# Altium project bzBldcRwDriver_Pcb_Ver02.PrjPcb
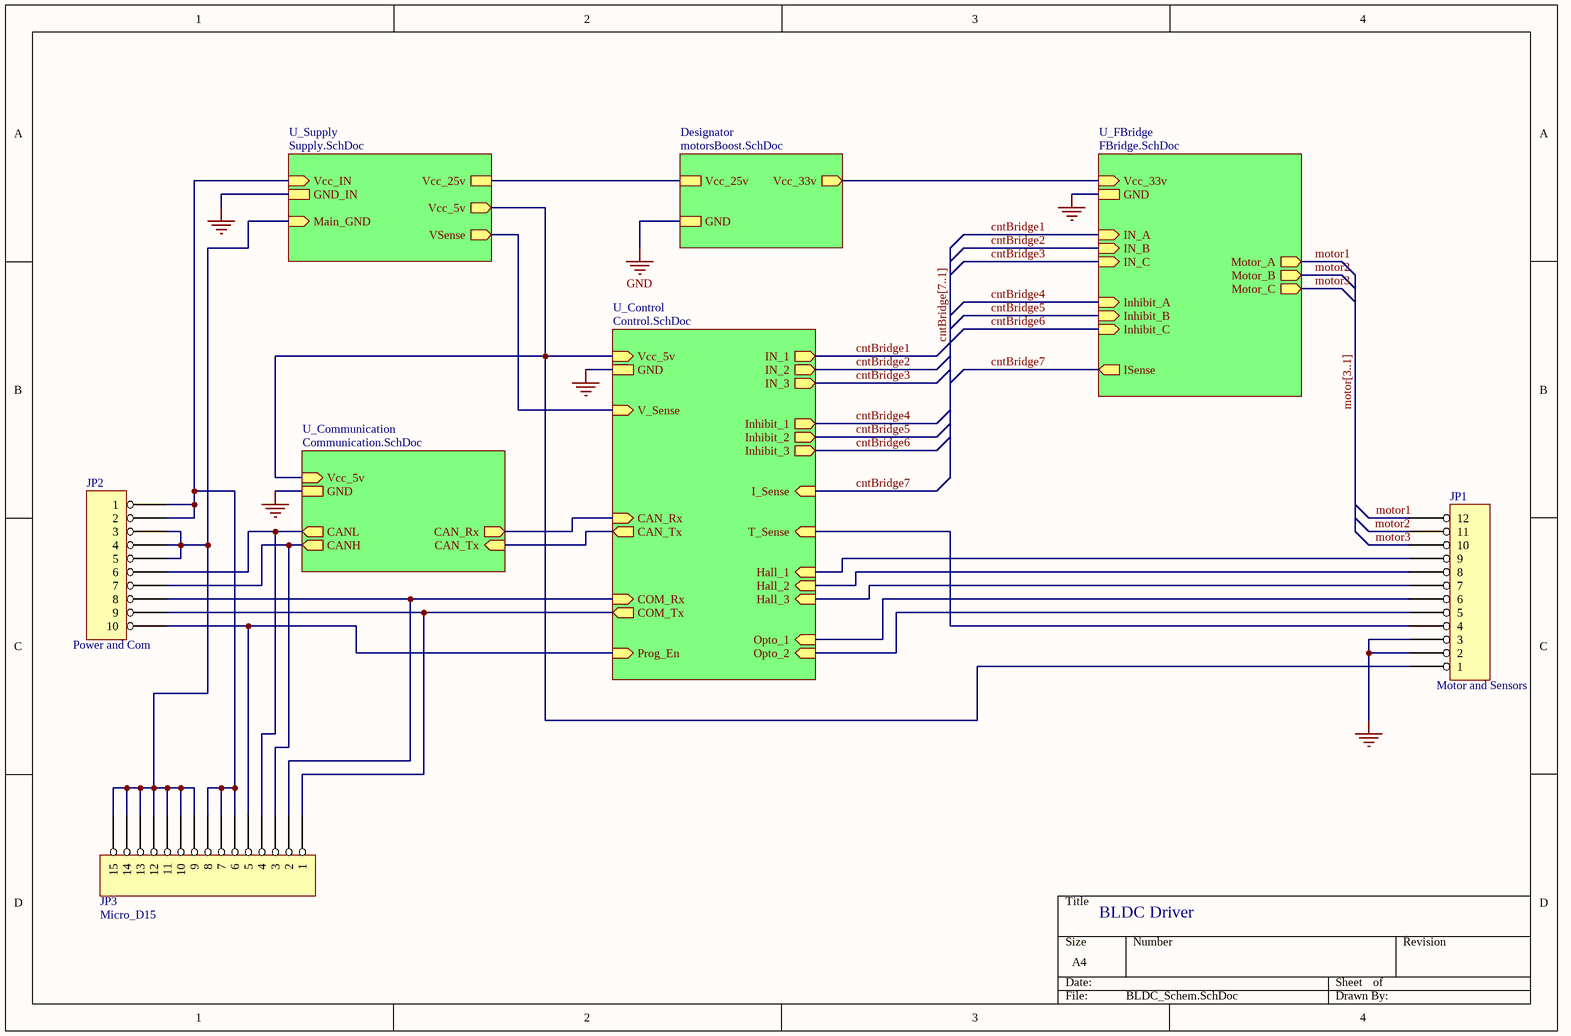
[diagram p0: BLDC_Schem.SchDoc]
6 sheets, 118 parts. Net scope: hierarchical (ports join the sheet entries above them; power ports are global).
Board file: bldcDriverVer02.PcbDoc
Sheets:
  BLDC_Schem.SchDoc
    U_Communication = Communication.SchDoc
    U_Control = Control.SchDoc
    U_FBridge = FBridge.SchDoc
    U_Supply = Supply.SchDoc
    Designator = MotorsBoost.SchDoc

## Sheet BLDC_Schem.SchDoc
size A4; SheetNumber: 1; SheetTotal: 6

### Parts
JP1  Motor and Sensors  [HDR1X12]
JP2  Power and Com  [HDR1X10]
JP3  Micro_D15  [Micro_D]

### Sub-sheets
Designator = motorsBoost.SchDoc: Vcc_25v, GND, Vcc_33v (out)
U_Communication = Communication.SchDoc: GND, Vcc_5v (in), CANL (out), CANH (out), CAN_Tx (in), CAN_Rx (out)
U_Control = Control.SchDoc: GND, I_Sense (in), Hall_2 (in), V_Sense (in), Hall_1 (in), Hall_3 (in), COM_Rx (in), COM_Tx (out), IN_1 (out), IN_2 (out), IN_3 (out), Inhibit_3 (out), Inhibit_2 (out), Inhibit_1 (out), Vcc_5v (in), Opto_1 (in), Opto_2 (in), CAN_Rx (in), CAN_Tx (out), T_Sense (in), Prog_En (in)
U_FBridge = FBridge.SchDoc: IN_A (in), Inhibit_A (in), Vcc_33v (in), GND, ISense (out), Motor_A (out), IN_B (in), Inhibit_B (in), Motor_B (out), IN_C (in), Inhibit_C (in), Motor_C (out)
U_Supply = Supply.SchDoc: Vcc_IN (in), GND_IN, Vcc_25v, Vcc_5v (out), VSense (out), Main_GND (in)

### Nets
Gnd: JP1.2 JP1.3 ; sheet U_Communication/GND, sheet U_Control/GND, sheet U_FBridge/GND, sheet U_Supply/GND_IN, sheet Designator/GND
cntBridge1: sheet U_Control/IN_1, sheet U_FBridge/IN_A
cntBridge2: sheet U_Control/IN_2, sheet U_FBridge/IN_B
cntBridge3: sheet U_Control/IN_3, sheet U_FBridge/IN_C
cntBridge4: sheet U_Control/Inhibit_1, sheet U_FBridge/Inhibit_A
cntBridge5: sheet U_Control/Inhibit_2, sheet U_FBridge/Inhibit_B
cntBridge6: sheet U_Control/Inhibit_3, sheet U_FBridge/Inhibit_C
cntBridge7: sheet U_Control/I_Sense, sheet U_FBridge/ISense
motor1: JP1.12 ; sheet U_FBridge/Motor_A
motor2: JP1.11 ; sheet U_FBridge/Motor_B
motor3: JP1.10 ; sheet U_FBridge/Motor_C
PORT_B0: JP1.7 ; sheet U_Control/Hall_3
PORTA_11: sheet U_Communication/CAN_Rx, sheet U_Control/CAN_Rx
PORTA_12: sheet U_Communication/CAN_Tx, sheet U_Control/CAN_Tx
PORTB_6: JP1.6 ; sheet U_Control/Opto_1
PORTB_7: JP1.5 ; sheet U_Control/Opto_2
Vcc_5: JP1.1 ; sheet U_Communication/Vcc_5v, sheet U_Control/Vcc_5v, sheet U_Supply/Vcc_5v
NetC13_1: sheet U_Supply/Vcc_25v, sheet Designator/Vcc_25v
NetC21_1: sheet U_FBridge/Vcc_33v, sheet Designator/Vcc_33v
NetC34_1: JP2.3 JP2.4 JP2.5 JP3.9 JP3.10 JP3.11 JP3.12 JP3.13 JP3.14 JP3.15 ; sheet U_Supply/Main_GND
NetFU1_1: JP2.1 JP2.2 JP3.6 JP3.7 JP3.8 ; sheet U_Supply/Vcc_IN
NetJP1_4: JP1.4 ; sheet U_Control/T_Sense
NetJP1_8: JP1.8 ; sheet U_Control/Hall_2
NetJP1_9: JP1.9 ; sheet U_Control/Hall_1
NetJP2_6: JP2.6 JP3.4 ; sheet U_Communication/CANL
NetJP2_7: JP2.7 JP3.3 ; sheet U_Communication/CANH
NetJP2_8: JP2.8 JP3.2 ; sheet U_Control/COM_Rx
NetJP2_9: JP2.9 JP3.1 ; sheet U_Control/COM_Tx
NetJP2_10: JP2.10 JP3.5 ; sheet U_Control/Prog_En
NetR15_1: sheet U_Control/V_Sense, sheet U_Supply/VSense

### Buses and harness runs
bus cntBridge[7..1]
bus motor[3..1]

### Notes on the sheet
- BLDC Driver

### Library data of the parts
JP1 = HEADER 12
JP2 = HEADER 10
JP3 = HEADER 15

## Sheet Communication.SchDoc
size A4; SheetNumber: 2; SheetTotal: 6
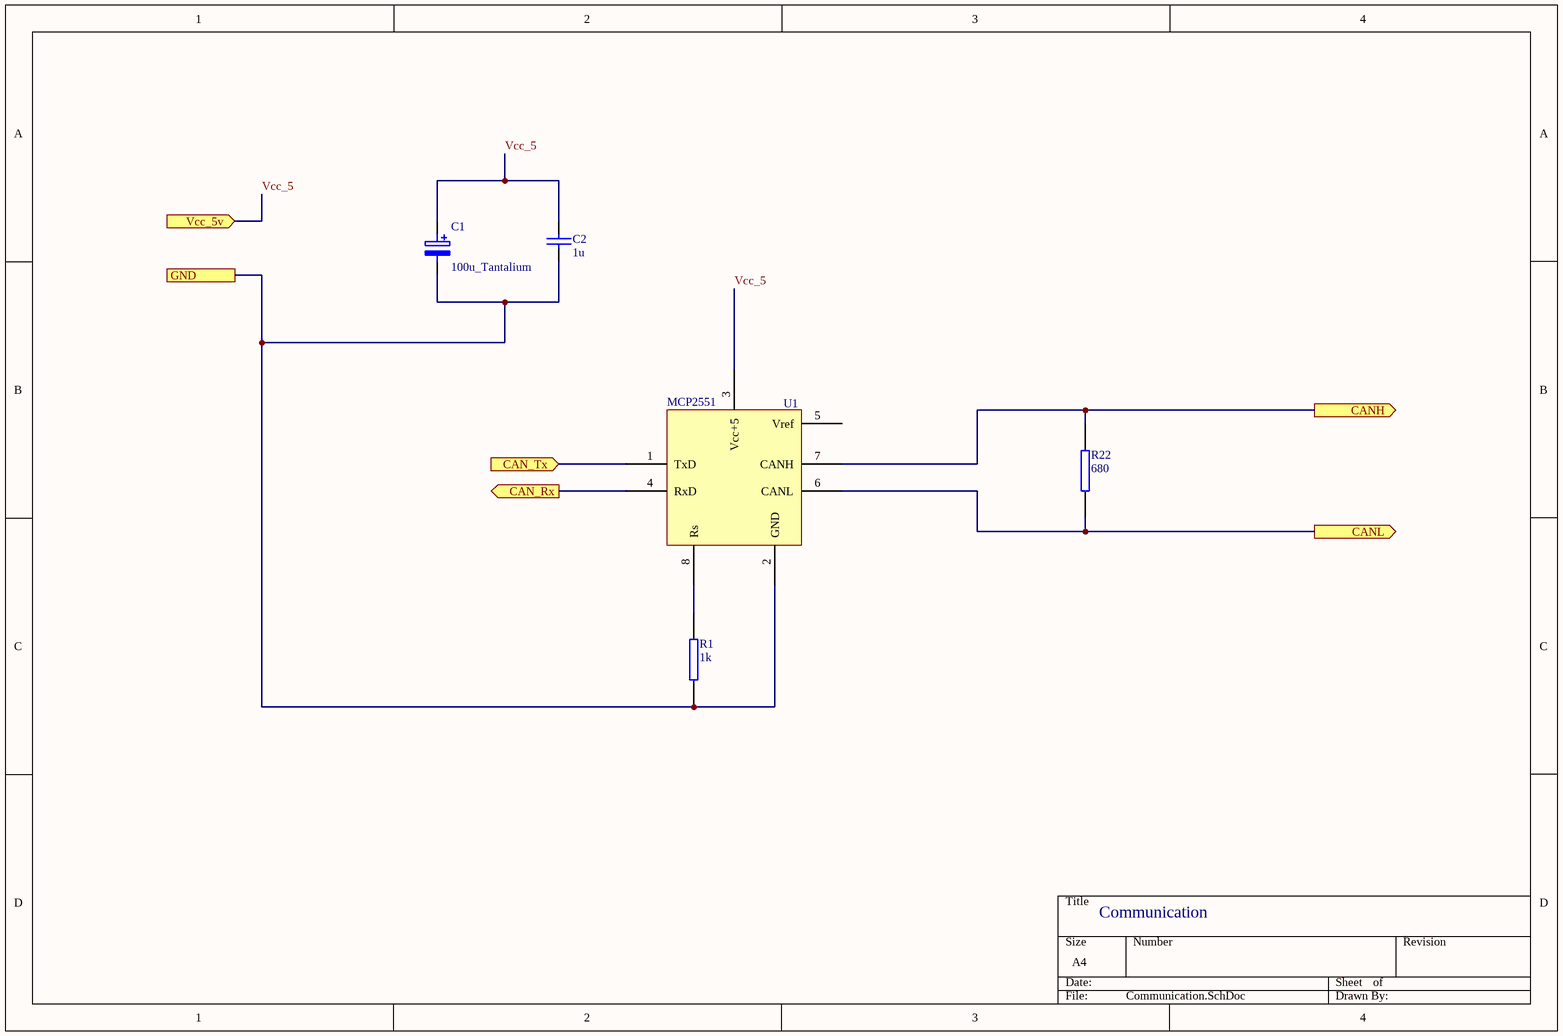
[diagram p1: Communication.SchDoc]

### Parts
C1  100u_Tantalium  [Tantalum_9545]
C2  1u  [1206_SMD]
R1  1k  [1206_SMD]
R22  680  [1206_SMD]
U1  MCP2551  [SOIC8]

### Ports
CAN_Rx (out), CAN_Tx (in), CANH (out), CANL (out), GND, Vcc_5v (in)

### Nets
Gnd: C1.2 C2.2 R1.1 U1.2(GND) ; port GND
PORTA_11: U1.4(RxD) ; port CAN_Rx
PORTA_12: U1.1(TxD) ; port CAN_Tx
Vcc_5: C1.1 C2.1 U1.3(Vcc+5) ; port Vcc_5v
NetJP2_6: R22.1 U1.6(CANL) ; port CANL
NetJP2_7: R22.2 U1.7(CANH) ; port CANH
NetR1_2: R1.2 U1.8(Rs)

Not connected (* = marked no-connect by the designer): U1 5(Vref)

### Notes on the sheet
- Communication

### Library data of the parts
C1 = CAP_ELECTRO
C2 = CAP: Capacitor
R1 R22 = RES2
U1 = CAN_Interface

## Sheet Control.SchDoc
size A4; SheetNumber: 3; SheetTotal: 6
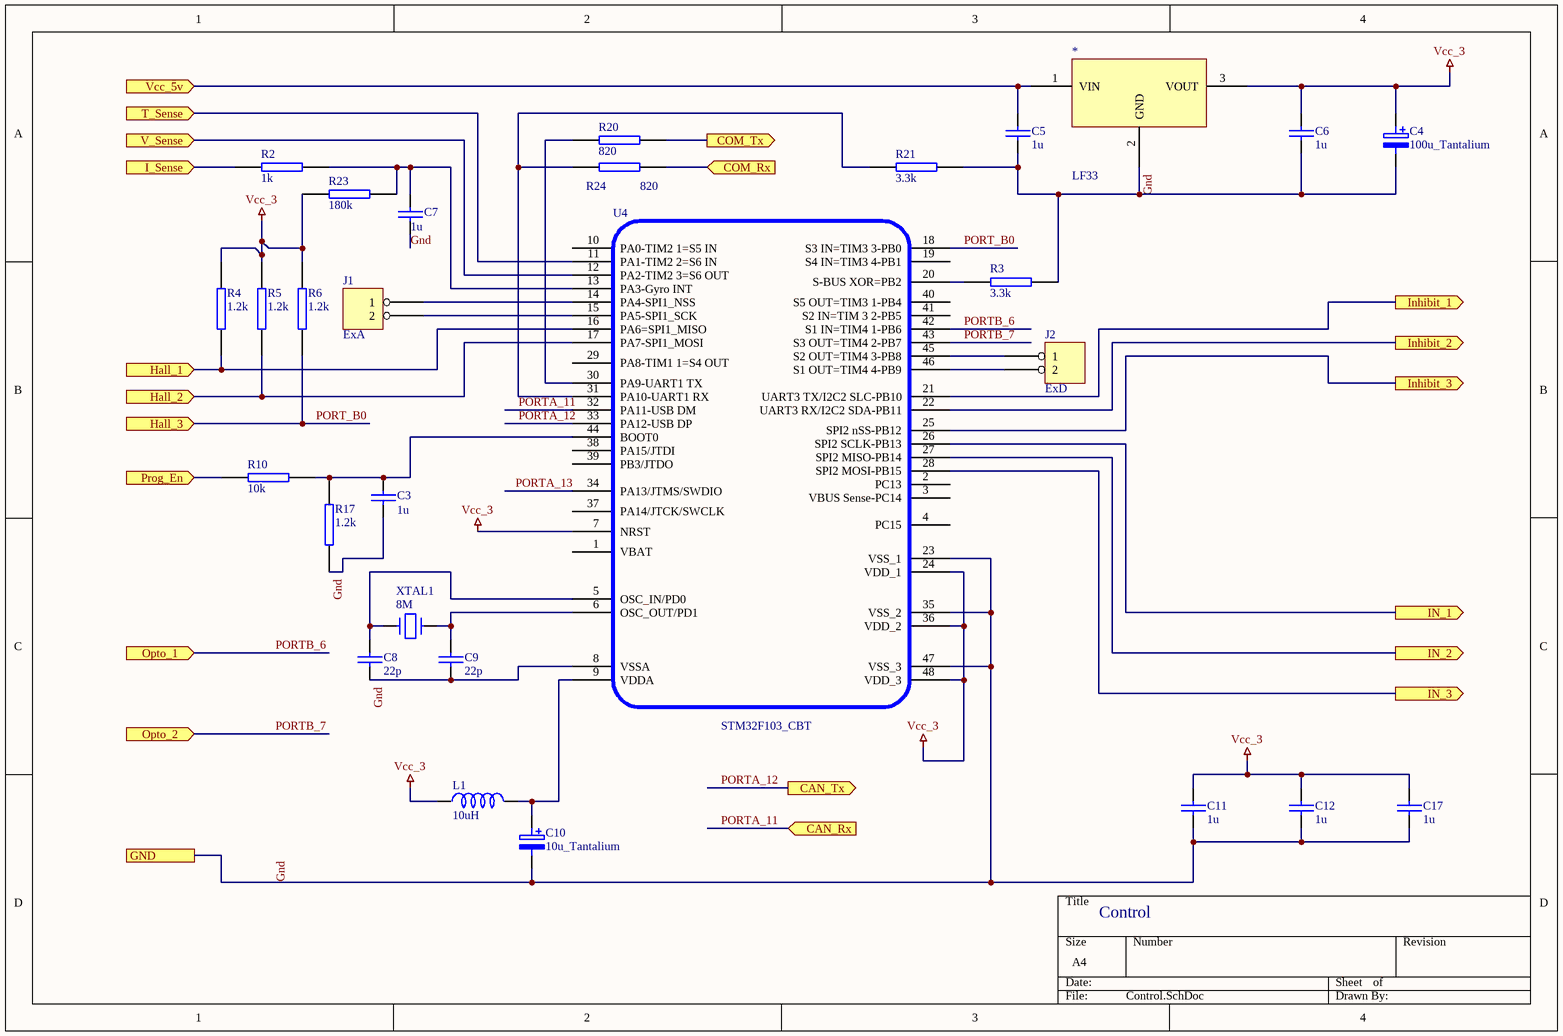
[diagram p2: Control.SchDoc]

### Parts
*  LF33  [Dpak]
C3  1u  [1206_SMD]
C4  100u_Tantalium  [Tantalum_9545]
C5  1u  [1206_SMD]
C6  1u  [1206_SMD]
C7  1u  [1206_SMD]
C8  22p  [0805]
C9  22p  [0805]
C10  10u_Tantalium  [Tantalum_9545]
C11  1u  [1206_SMD]
C12  1u  [1206_SMD]
C17  1u  [1206_SMD]
J1  ExA  [MHDR1X2]
J2  ExD  [MHDR1X2]
L1  10uH  [1206_SMD]
R2  1k  [0805]
R3  3.3k  [0805]
R4  1.2k  [1206_SMD]
R5  1.2k  [1206_SMD]
R6  1.2k  [1206_SMD]
R10  10k  [0805]
R17  1.2k  [0805]
R20  820  [0805]
R21  3.3k  [0805]
R23  180k  [0805]
R24  820  [0805]
U4  STM32F103_CBT  [LQFP48]
XTAL1  8M  [xtal]

### Ports
CAN_Rx (in), CAN_Tx (out), COM_Rx (in), COM_Tx (out), GND, Hall_1 (in), Hall_2 (in), Hall_3 (in), I_Sense (in), IN_1 (out), IN_2 (out), IN_3 (out), Inhibit_1 (out), Inhibit_2 (out), Inhibit_3 (out), Opto_1 (in), Opto_2 (in), Prog_En (in), T_Sense (in), V_Sense (in), Vcc_5v (in)

### Nets
Gnd  : *.2(GND) C3.2 C4.2 C5.2 C6.2 C7.2 C8.2 C9.2 C10.2 C11.2 C12.2 C17.2 R3.1 R17.1 R21.1 U4.8(VSSA) U4.23(VSS_1) U4.35(VSS_2) U4.47(VSS_3) ; port GND  [project net Gnd]
Vcc_3: *.3(VOUT) C4.1 C6.1 C11.1 C12.1 C17.1 L1.1 R4.2 R5.2 R6.2 R23.2 U4.7(NRST) U4.24(VDD_1) U4.36(VDD_2) U4.48(VDD_3)
cntBridge1: U4.26(SPI2_SCLK-PB13) ; port IN_1
cntBridge2: U4.27(SPI2_MISO-PB14) ; port IN_2
cntBridge3: U4.28(SPI2_MOSI-PB15) ; port IN_3
cntBridge4: U4.21(UART3_TX/I2C2_SLC-PB10) ; port Inhibit_1
cntBridge5: U4.22(UART3_RX/I2C2_SDA-PB11) ; port Inhibit_2
cntBridge6: U4.25(SPI2_nSS-PB12) ; port Inhibit_3
cntBridge7: R2.1 ; port I_Sense
PORT_B0: R6.1 U4.18(S3_IN=TIM3_3-PB0) ; port Hall_3
PORTA_11: U4.32(PA11-USB_DM) ; port CAN_Rx
PORTA_12: U4.33(PA12-USB_DP) ; port CAN_Tx
PORTA_13: U4.34(PA13/JTMS/SWDIO)
PORTB_6: U4.42(S1_IN=TIM4_1-PB6) ; port Opto_1
PORTB_7: U4.43(S3_OUT=TIM4_2-PB7) ; port Opto_2
Vcc_5: *.1(VIN) C5.1 ; port Vcc_5v
NetC3_1: C3.1 R10.1 R17.2 U4.44(BOOT0)
NetC7_1: C7.1 R2.2 R23.1 U4.13(PA3-Gyro_INT)
NetC8_1: C8.1 U4.5(OSC_IN/PD0) XTAL1.1
NetC9_1: C9.1 U4.6(OSC_OUT/PD1) XTAL1.2
NetC10_1: C10.1 L1.2 U4.9(VDDA)
NetJ1_1: J1.1 U4.14(PA4-SPI1_NSS)
NetJ1_2: J1.2 U4.15(PA5-SPI1_SCK)
NetJ2_1: J2.1 U4.45(S2_OUT=TIM4_3-PB8)
NetJ2_2: J2.2 U4.46(S1_OUT=TIM4_4-PB9)
NetJP1_4: U4.11(PA1-TIM2_2=S6_IN) ; port T_Sense
NetJP1_8: R5.1 U4.17(PA7-SPI1_MOSI) ; port Hall_2
NetJP1_9: R4.1 U4.16(PA6=SPI1_MISO) ; port Hall_1
NetJP2_8: R24.1 ; port COM_Rx
NetJP2_9: R20.1 ; port COM_Tx
NetJP2_10: R10.2 ; port Prog_En
NetR3_2: R3.2 U4.20(S-BUS_XOR=PB2)
NetR15_1: U4.12(PA2-TIM2_3=S6_OUT) ; port V_Sense
NetR20_2: R20.2 U4.30(PA9-UART1_TX)
NetR21_2: R21.2 R24.2 U4.31(PA10-UART1_RX)

Not connected (* = marked no-connect by the designer): U4 1(VBAT) 2(PC13) 3(VBUS_Sense-PC14) 4(PC15) 10(PA0-TIM2_1=S5_IN) 19(S4_IN=TIM3_4-PB1) 29(PA8-TIM1_1=S4_OUT) 37(PA14/JTCK/SWCLK) 38(PA15/JTDI) 39(PB3/JTDO) 40(S5_OUT=TIM3_1-PB4) 41(S2_IN=TIM_3_2-PB5)

### Notes on the sheet
- Control

### Library data of the parts
C3 C5-C9 C11 C12 C17 = CAP: Capacitor
C4 C10 = CAP_ELECTRO
J1 J2 = HEADER 2
L1 = INDUCTOR
R2-R6 R10 R17 R20 R21 R23 R24 = RES2
U4 = STM32F103_CBT: ST Microcontroller
XTAL1 = CRYSTAL

## Sheet FBridge.SchDoc
size A4; SheetNumber: 4; SheetTotal: 6
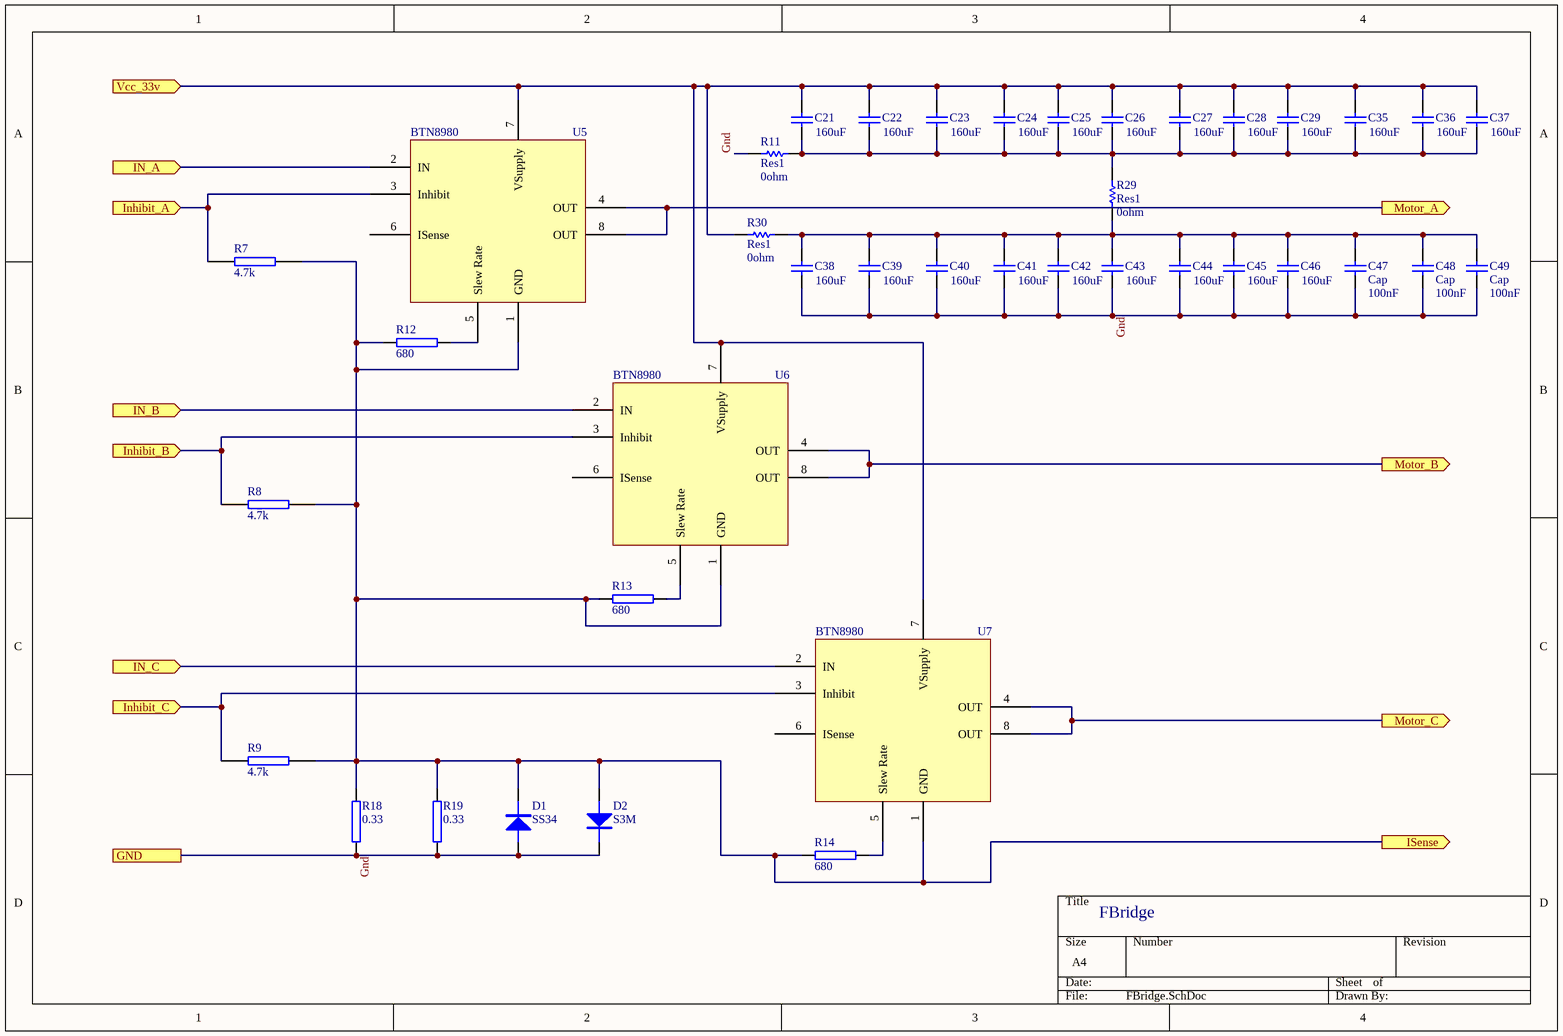
[diagram p3: FBridge.SchDoc]

### Parts
C21  value 160uF  [Tantalum_9545]  (hidden comment: Cap)
C22  value 160uF  [Tantalum_9545]  (hidden comment: Cap)
C23  value 160uF  [Tantalum_9545]  (hidden comment: Cap)
C24  value 160uF  [Tantalum_9545]  (hidden comment: Cap)
C25  value 160uF  [Tantalum_9545]  (hidden comment: Cap)
C26  value 160uF  [Tantalum_9545]  (hidden comment: Cap)
C27  value 160uF  [Tantalum_9545]  (hidden comment: Cap)
C28  value 160uF  [Tantalum_9545]  (hidden comment: Cap)
C29  value 160uF  [Tantalum_9545]  (hidden comment: Cap)
C35  value 160uF  [Tantalum_9545]  (hidden comment: Cap)
C36  value 160uF  [Tantalum_9545]  (hidden comment: Cap)
C37  value 160uF  [Tantalum_9545]  (hidden comment: Cap)
C38  value 160uF  [Tantalum_9545]  (hidden comment: Cap)
C39  value 160uF  [Tantalum_9545]  (hidden comment: Cap)
C40  value 160uF  [Tantalum_9545]  (hidden comment: Cap)
C41  value 160uF  [Tantalum_9545]  (hidden comment: Cap)
C42  value 160uF  [Tantalum_9545]  (hidden comment: Cap)
C43  value 160uF  [Tantalum_9545]  (hidden comment: Cap)
C44  value 160uF  [Tantalum_9545]  (hidden comment: Cap)
C45  value 160uF  [Tantalum_9545]  (hidden comment: Cap)
C46  value 160uF  [Tantalum_9545]  (hidden comment: Cap)
C47  Cap  value 100nF  [1206_SMD]
C48  Cap  value 100nF  [1206_SMD]
C49  Cap  value 100nF  [1206_SMD]
D1  SS34  [SMA]
D2  S3M  [SMC]
R7  4.7k  [1206_SMD]
R8  4.7k  [1206_SMD]
R9  4.7k  [1206_SMD]
R11  Res1  value 0ohm  [2010_smd]
R12  680  [1206_SMD]
R13  680  [1206_SMD]
R14  680  [1206_SMD]
R18  0.33  [2010_smd]
R19  0.33  [2010_smd]
R29  Res1  value 0ohm  [2010_smd]
R30  Res1  value 0ohm  [2010_smd]
U5  BTN8980  [TO263_7]
U6  BTN8980  [TO263_7]
U7  BTN8980  [TO263_7]

### Ports
GND, IN_A (in), IN_B (in), IN_C (in), Inhibit_A (in), Inhibit_B (in), Inhibit_C (in), ISense (out), Motor_A (out), Motor_B (out), Motor_C (out), Vcc_33v (in)

### Nets
Gnd: C38.2 C39.2 C40.2 C41.2 C42.2 C43.2 C44.2 C45.2 C46.2 C47.1 C48.1 C49.1 D1.A D2.K R11.1 R18.1 R19.1 ; port GND
cntBridge1: U5.2(IN) ; port IN_A
cntBridge2: U6.2(IN) ; port IN_B
cntBridge3: U7.2(IN) ; port IN_C
cntBridge4: R7.1 U5.3(Inhibit) ; port Inhibit_A
cntBridge5: R8.1 U6.3(Inhibit) ; port Inhibit_B
cntBridge6: R9.1 U7.3(Inhibit) ; port Inhibit_C
cntBridge7: D1.K D2.A R7.2 R8.2 R9.2 R12.2 R13.2 R14.2 R18.2 R19.2 U5.1(GND) U6.1(GND) U7.1(GND) ; port ISense
motor1: U5.4(OUT) U5.8(OUT) ; port Motor_A
motor2: U6.4(OUT) U6.8(OUT) ; port Motor_B
motor3: U7.4(OUT) U7.8(OUT) ; port Motor_C
NetC21_1: C21.1 C22.1 C23.1 C24.1 C25.1 C26.1 C27.1 C28.1 C29.1 C35.1 C36.1 C37.1 R30.1 U5.7(VSupply) U6.7(VSupply) U7.7(VSupply) ; port Vcc_33v
NetC21_2: C21.2 C22.2 C23.2 C24.2 C25.2 C26.2 C27.2 C28.2 C29.2 C35.2 C36.2 C37.2 R11.2 R29.2
NetC38_1: C38.1 C39.1 C40.1 C41.1 C42.1 C43.1 C44.1 C45.1 C46.1 C47.2 C48.2 C49.2 R29.1 R30.2
NetR12_1: R12.1 U5.5(Slew_Rate)
NetR13_1: R13.1 U6.5(Slew_Rate)
NetR14_1: R14.1 U7.5(Slew_Rate)

Not connected (* = marked no-connect by the designer): U5 6(ISense); U6 6(ISense); U7 6(ISense)

### Notes on the sheet
- FBridge

### Library data of the parts
C21-C29 C35-C49 = Cap: Capacitor; Published: 8-Jun-2000; LatestRevisionDate: 17-Jul-2002; LatestRevisionNote: Re-released for DXP Platform.; PackageReference: RAD-0.3; Publisher: Altium Limited; PackageDescription: Radial Cap, Thru-Hole; 2 Leads; 0.3 in Pin Spacing
D1 = DIODE
D2 = DIODE: pin to pad: A>1 K>2
R7-R9 R12-R14 R18 R19 = RES2
R11 R29 R30 = Res1: Resistor; Published: 8-Jun-2000; LatestRevisionDate: 17-Jul-2002; LatestRevisionNote: Re-released for DXP Platform.; PackageReference: AXIAL-0.3; Publisher: Altium Limited; PackageDescription: Axial Device, Thru-Hole; 2 Leads; 0.3 in Pin Spacing

## Sheet Supply.SchDoc
size A4; SheetNumber: 5; SheetTotal: 6
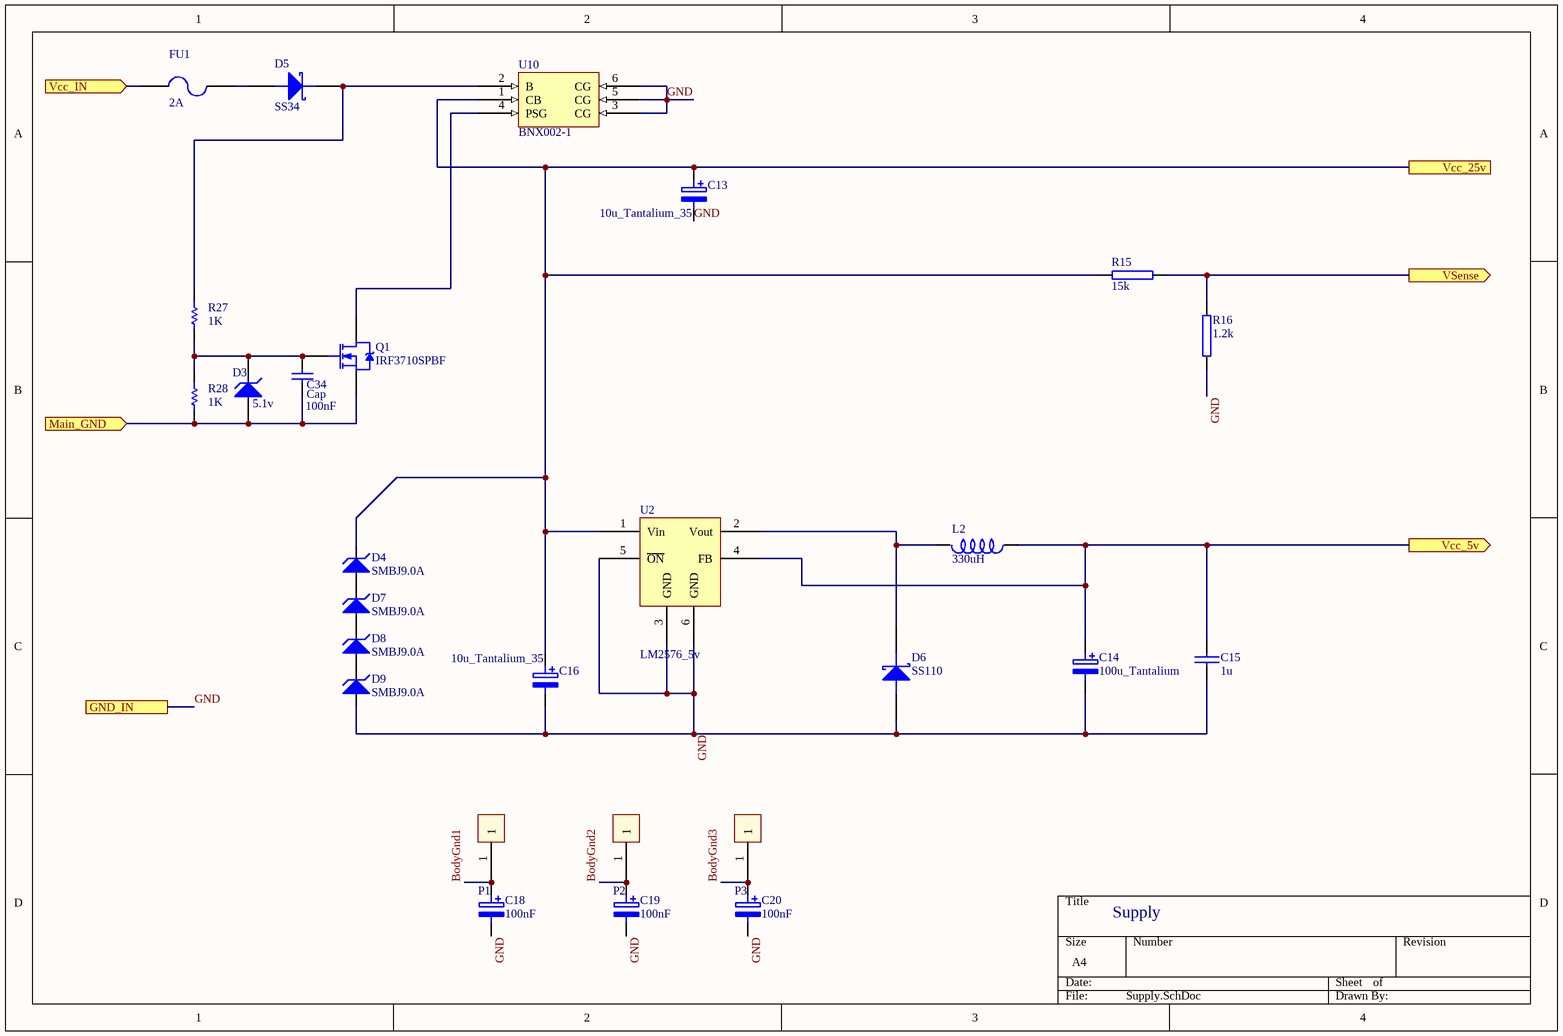
[diagram p4: Supply.SchDoc]

### Parts
C13  10u_Tantalium_35  [Tantalum_9545]
C14  100u_Tantalium  [Tantalum_9545]
C15  1u  [0805]
C16  10u_Tantalium_35  [Tantalum_9545]
C18  100nF  [1206_SMD]
C19  100nF  [1206_SMD]
C20  100nF  [1206_SMD]
C34  Cap  value 100nF  [1206_SMD]
D3  5.1v  [diode zener_smd]
D4  SMBJ9.0A  [SMB]
D5  SS34  [SMC]
D6  SS110  [SMA]
D7  SMBJ9.0A  [SMB]
D8  SMBJ9.0A  [SMB]
D9  SMBJ9.0A  [SMB]
FU1  2A  [7227]
L2  330uH  [inductor_12.3*12.3]
P1  head1  [PAD]  (value not drawn)
P2  head1  [PAD]  (value not drawn)
P3  head1  [PAD]  (value not drawn)
Q1  IRF3710SPBF  [D2PAK]
R15  15k  [1206_SMD]
R16  1.2k  [1206_SMD]
R27  value 1K  [0805_smd]  (hidden comment: Res1)
R28  value 1K  [0805]  (hidden comment: Res1)
U2  LM2576_5v  [TO263-5L]
U10  BNX002-1  [BNX002-1]

### Ports
GND_IN, Main_GND (in), Vcc_5v (out), Vcc_25v, Vcc_IN (in), VSense (out)

### Nets
Gnd: C13.2 C14.2 C15.2 C16.2 C18.2 C19.2 C20.2 D6.A D9.A R16.1 U2.3(GND) U2.5(~{ON}) U2.6(GND) U10.3(CG) U10.5(CG) U10.6(CG) ; port GND_IN
BodyGnd1: C18.1 P1.1
BodyGnd2: C19.1 P2.1
BodyGnd3: C20.1 P3.1
Vcc_5: C14.1 C15.1 L2.1 U2.4(FB) ; port Vcc_5v
NetC13_1: C13.1 C16.1 D4.K R15.2 U2.1(Vin) U10.1(CB) ; port Vcc_25v
NetC34_1: C34.1 D3.1(A) Q1.3(S) R28.1 ; port Main_GND
NetC34_2: C34.2 D3.2(K) Q1.1(G) R27.1 R28.2
NetD4_A: D4.A D7.K
NetD5_A: D5.A FU1.2
NetD5_K: D5.K R27.2 U10.2(B)
NetD6_K: D6.K L2.2 U2.2(Vout)
NetD7_A: D7.A D8.K
NetD8_A: D8.A D9.K
NetFU1_1: FU1.1 ; port Vcc_IN
NetQ1_2: Q1.2(D) U10.4(PSG)
NetR15_1: R15.1 R16.2 ; port VSense

### Notes on the sheet
- Supply

### Library data of the parts
C13 C14 C16 C18-C20 = CAP_ELECTRO
C15 = CAP: Capacitor
C34 = Cap: Capacitor; Published: 8-Jun-2000; LatestRevisionDate: 17-Jul-2002; LatestRevisionNote: Re-released for DXP Platform.; PackageReference: RAD-0.3; Publisher: Altium Limited; PackageDescription: Radial Cap, Thru-Hole; 2 Leads; 0.3 in Pin Spacing
D3 = D Zener: Zener Diode; pin to pad: 1>A 2>K; Published: 8-Jun-2000; LatestRevisionDate: 17-Jul-2002; LatestRevisionNote: Re-released for DXP Platform.; PackageReference: DIODE-0.7; Publisher: Altium Limited; PackageDescription: Diode, Thru-Hole; 2 Leads; 0.7 in Pin Spacing
D4 D7-D9 = ZENER: pin to pad: A>1 K>2
D5 = DIODE_SCH: pin to pad: A>1 K>2
D6 = DIODE_SCH
FU1 = FUSE2: Fuse
L2 = INDUCTOR
Q1 = NMOS-2: N-Channel Power MOSFET; Note: Pin 2 is electrically connected to pin 4.; Published: 8-Jun-2000; LatestRevisionDate: 17-Jul-2002; LatestRevisionNote: Re-released for DXP Platform.; DatasheetVersion: PD-9.814; PackageVersion: Feb-1997; PackageReference: TO-220AB; Publisher: Altium Limited; PackageDescription: TO, Thru-Hole, Vertical, Heatsink Mounted; 3 In-Line Leads; Pitch 2.54 mm; ComponentLink1Description: Manufacturer Link; ComponentLink1URL: http://www.irf.com/
R15 R16 = RES2
R27 R28 = Res1: Resistor; Published: 8-Jun-2000; LatestRevisionDate: 17-Jul-2002; LatestRevisionNote: Re-released for DXP Platform.; PackageReference: AXIAL-0.3; Publisher: Altium Limited; PackageDescription: Axial Device, Thru-Hole; 2 Leads; 0.3 in Pin Spacing
U10 = BNX002-1: EMI FILTERS

## Sheet MotorsBoost.SchDoc
size A3; SheetNumber: 6; SheetTotal: 6
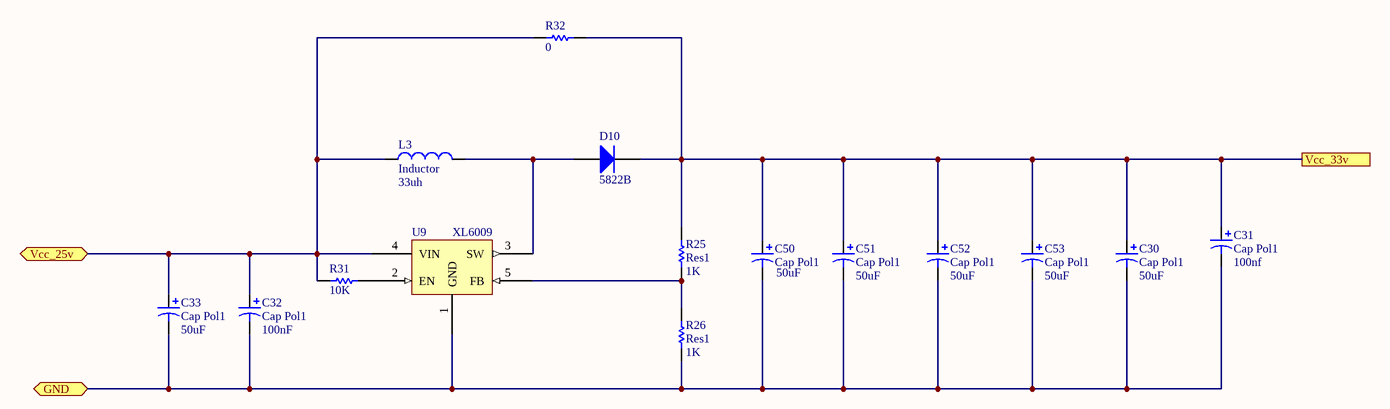
[diagram p5: MotorsBoost.SchDoc]

### Parts
C30  Cap Pol1  value 50uF  [Tantalum_9545]
C31  Cap Pol1  value 100nf  [1206_SMD]
C32  Cap Pol1  value 100nF  [1206_SMD]
C33  Cap Pol1  value 50uF  [Tantalum_9545]
C50  Cap Pol1  value 50uF  [Tantalum_9545]
C51  Cap Pol1  value 50uF  [Tantalum_9545]
C52  Cap Pol1  value 50uF  [Tantalum_9545]
C53  Cap Pol1  value 50uF  [Tantalum_9545]
D10  5822B  [SMB]
L3  Inductor  value 33uh  [inductor_12.3*12.3]
R25  Res1  value 1K  [0805_smd]
R26  Res1  value 1K  [0805_smd]
R31  10K  [0805_smd]
R32  0  [2010_smd]
U9  XL6009  [TO263-5L]

### Ports
GND (bidir), Vcc_25v (bidir), Vcc_33v

### Nets
Gnd: C30.2 C31.2 C32.2 C33.2 C50.2 C51.2 C52.2 C53.2 R26.1 U9.1(GND) ; port GND
NetC13_1: C32.1 C33.1 L3.1 R31.1 R32.1 U9.4(VIN) ; port Vcc_25v
NetC21_1: C30.1 C31.1 C50.1 C51.1 C52.1 C53.1 D10.2(K) R25.2 R32.2 ; port Vcc_33v
NetD10_1: D10.1(A) L3.2 U9.3(SW)
NetR25_1: R25.1 R26.2 U9.5(FB)
NetR31_2: R31.2 U9.2(EN)

### Library data of the parts
C30-C33 C50-C53 = Cap Pol1: Polarized Capacitor (Radial); Published: 8-Jun-2000; LatestRevisionDate: 17-Jul-2002; LatestRevisionNote: Re-released for DXP Platform.; PackageReference: RB7.6-15; Publisher: Altium Limited; PackageDescription: Polarized Capacitor (Radial); 2 Leads
D10 = Diode: Default Diode; Published: 8-Jun-2000; LatestRevisionDate: 17-Jul-2002; LatestRevisionNote: Re-released for DXP Platform.; PackageVersion: Sep-1996; PackageReference: SMC; Publisher: Altium Limited; PackageDescription: DO-214-AB/SMC; 2 C-Bend Leads; Body 7.9 x 5.9 mm, inc. leads (LxW); Code_JEDEC: DO-214-AB
L3 = Inductor: Code_IEC: 1005; Published: 8-Jun-2000; LatestRevisionDate: 29-May-2009; LatestRevisionNote: IPC-7351 Footprint Added.; PackageReference: 0402-A; Publisher: Altium Limited; PackageDescription: Chip Inductor; Code_JEITA: 0402
R25 R26 R31 R32 = Res1: Resistor; Published: 8-Jun-2000; LatestRevisionDate: 17-Jul-2002; LatestRevisionNote: Re-released for DXP Platform.; PackageReference: AXIAL-0.3; Publisher: Altium Limited; PackageDescription: Axial Device, Thru-Hole; 2 Leads; 0.3 in Pin Spacing
  R31: Value: 10K
  R32: Value: 0
U9 = XL6009: Voltage Booster

## Nets that join several sheets
Gnd: BLDC_Schem (JP1.2 JP1.3), Communication (C1.2 C2.2 R1.1 U1.2), Control (19 pins), FBridge (17 pins), Supply (16 pins), MotorsBoost (10 pins)
cntBridge1: Control (U4.26), FBridge (U5.2)
cntBridge2: Control (U4.27), FBridge (U6.2)
cntBridge3: Control (U4.28), FBridge (U7.2)
cntBridge4: Control (U4.21), FBridge (R7.1 U5.3)
cntBridge5: Control (U4.22), FBridge (R8.1 U6.3)
cntBridge6: Control (U4.25), FBridge (R9.1 U7.3)
cntBridge7: Control (R2.1), FBridge (13 pins)
motor1: BLDC_Schem (JP1.12), FBridge (U5.4 U5.8)
motor2: BLDC_Schem (JP1.11), FBridge (U6.4 U6.8)
motor3: BLDC_Schem (JP1.10), FBridge (U7.4 U7.8)
NetC13_1: Supply (6 pins), MotorsBoost (6 pins)
NetC21_1: FBridge (16 pins), MotorsBoost (9 pins)
NetC34_1: BLDC_Schem (10 pins), Supply (C34.1 D3.1 Q1.3 R28.1)
NetFU1_1: BLDC_Schem (5 pins), Supply (FU1.1)
NetJP1_4: BLDC_Schem (JP1.4), Control (U4.11)
NetJP1_8: BLDC_Schem (JP1.8), Control (R5.1 U4.17)
NetJP1_9: BLDC_Schem (JP1.9), Control (R4.1 U4.16)
NetJP2_6: BLDC_Schem (JP2.6 JP3.4), Communication (R22.1 U1.6)
NetJP2_7: BLDC_Schem (JP2.7 JP3.3), Communication (R22.2 U1.7)
NetJP2_8: BLDC_Schem (JP2.8 JP3.2), Control (R24.1)
NetJP2_9: BLDC_Schem (JP2.9 JP3.1), Control (R20.1)
NetJP2_10: BLDC_Schem (JP2.10 JP3.5), Control (R10.2)
NetR15_1: Control (U4.12), Supply (R15.1 R16.2)
PORT_B0: BLDC_Schem (JP1.7), Control (R6.1 U4.18)
PORTA_11: Communication (U1.4), Control (U4.32)
PORTA_12: Communication (U1.1), Control (U4.33)
PORTB_6: BLDC_Schem (JP1.6), Control (U4.42)
PORTB_7: BLDC_Schem (JP1.5), Control (U4.43)
Vcc_5: BLDC_Schem (JP1.1), Communication (C1.1 C2.1 U1.3), Control (*.1 C5.1), Supply (C14.1 C15.1 L2.1 U2.4)